# Altium schematic sheet AC_Block.SchDoc
size A4; SheetNumber: 4; SheetTotal: 9
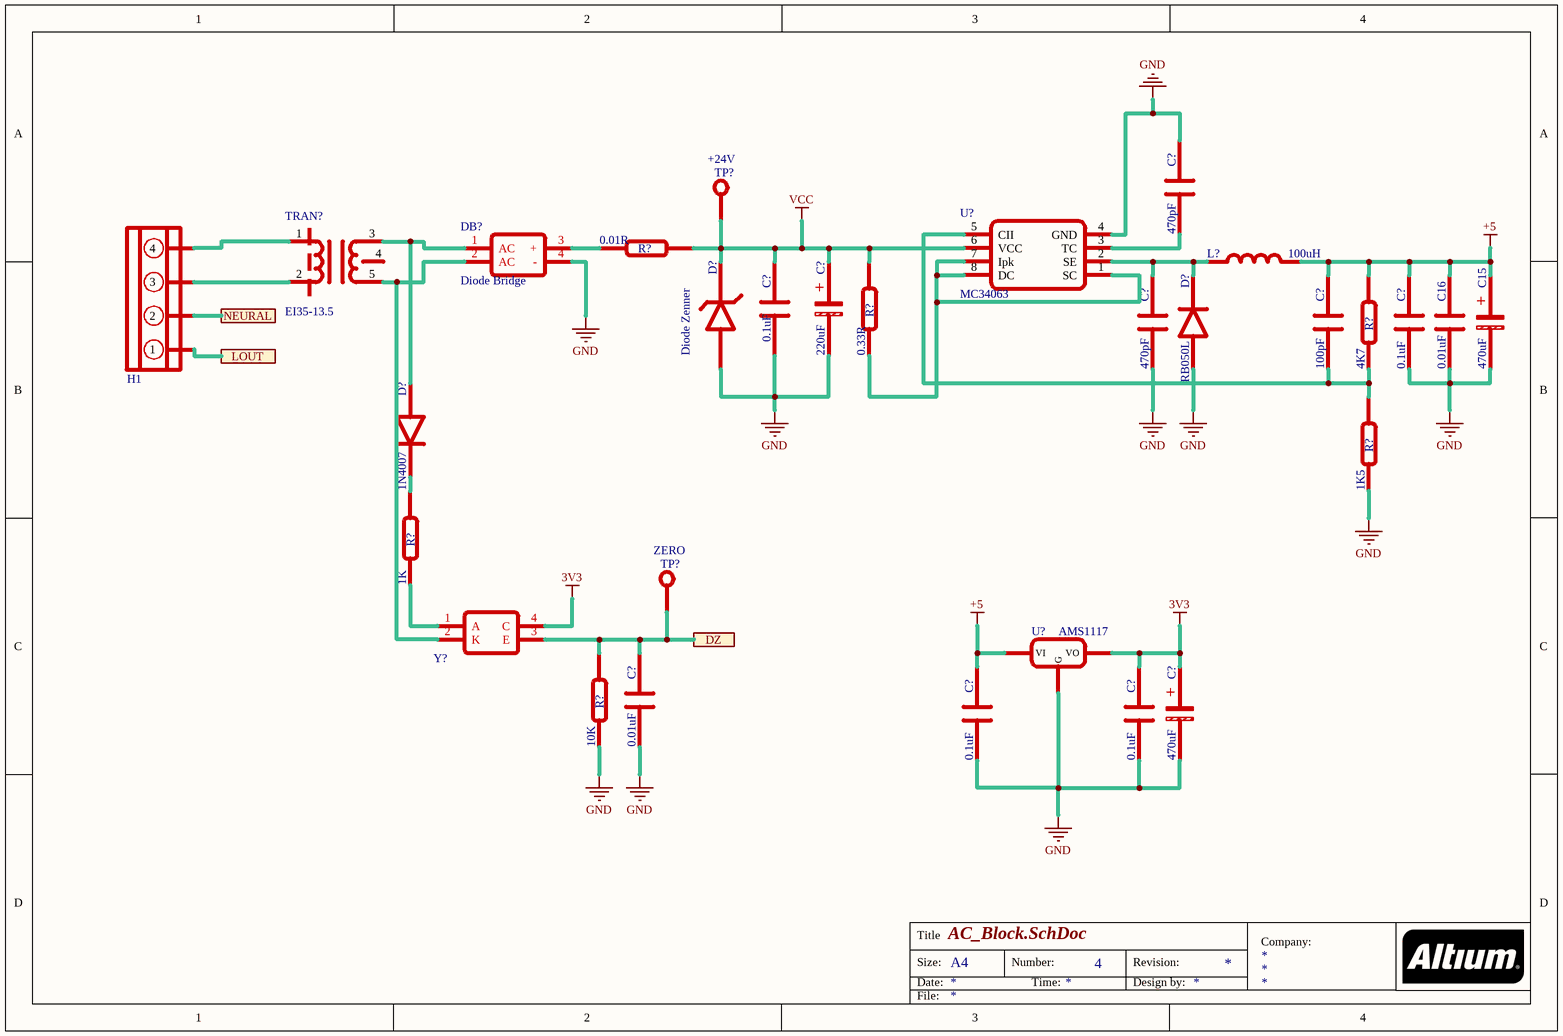
[diagram p0: AC_Block.SchDoc]

## Parts
(Parts that share a designator on the sheet are numbered #1, #2 ... from top to bottom, then left to right.)
C15  470uF  [CAP-AL-4x5.4]
C16  0.01uF  [C0603]
C?#1  470pF  [C0603]
C?#2  0.1uF  [C0402]
C?#3  220uF  [CAP-AL-4x5.4]
C?#4  470pF  [C0603]
C?#5  100pF  [C0603]
C?#6  0.1uF  [C0603]
C?#7  0.01uF  [C0402]
C?#8  0.1uF  [C0402]
C?#9  0.1uF  [C0402]
C?#10  470uF  [CAP-AL-4x5.4]
D?#1  Diode Zenner  [DIODE-1/2W-SMD-MELF]
D?#2  RB050L  [SMA]
D?#3  1N4007  [SMA]
DB?  Diode Bridge  [MBS-4]
H1  DG125-5.08-4P  [DG125-5.08-4P]  (value not drawn)
L?  100uH  [IND1206]
R?#1  0.01R  [R0603]
R?#2  0.33R  [R0603]
R?#3  4K7  [R0603]
R?#4  1K5  [R0603]
R?#5  1K  [R0603]
R?#6  10K  [R0603]
TP?#1  +24V  [Test Point]
TP?#2  ZERO  [Test Point]
TRAN?  EI35-13.5  [ZN35135BA]
U?#1  MC34063  [SOIC-8]
U?#2  AMS1117  [SOT-223]
Y?  PC817  [SOP-4]  (value not drawn)

## Ports
DZ, LOUT, NEURAL

## Nets
3V3: C?#9.2 C?#10.1 U?#2.2(VO) Y?.4(C)
+5: C15.1 C16.2 C?#5.2 C?#6.2 C?#8.2 L?.2 R?#3.2 U?#2.3(VI)
GND: C15.2 C16.1 C?#1.2 C?#2.1 C?#3.2 C?#4.1 C?#6.1 C?#7.1 C?#8.1 C?#9.1 C?#10.2 D?#1.A D?#2.A DB?.4(-) R?#4.1 R?#6.1 U?#1.4(GND) U?#2.1(G)
VCC: C?#2.2 C?#3.1 D?#1.K R?#1.2 R?#2.2 TP?#1.1 U?#1.6(VCC)
DZ: C?#7.2 R?#6.2 TP?#2.1 Y?.3(E) ; port DZ
LOUT: H1.1 ; port LOUT
NEURAL: H1.2 ; port NEURAL
NetC?#1_1: C?#1.1 U?#1.3(TC)
NetC?#4_2: C?#4.2 D?#2.K L?.1 U?#1.2(SE)
NetC?#5_1: C?#5.1 R?#3.1 R?#4.2 U?#1.5(CII)
NetD?#3_A: D?#3.A DB?.1(AC) TRAN?.3
NetD?#3_K: D?#3.K R?#5.2
NetDB?_2: DB?.2(AC) TRAN?.5 Y?.2(K)
NetDB?_3: DB?.3(+) R?#1.1
NetH1_3: H1.3 TRAN?.2
NetH1_4: H1.4 TRAN?.1
NetR?#2_1: R?#2.1 U?#1.1(SC) U?#1.7(Ipk) U?#1.8(DC)
NetR?#5_1: R?#5.1 Y?.1(A)

Not connected (* = marked no-connect by the designer): TRAN? 4

## Notes on the sheet
- Title
- Size:
- Date:
- A4
- Number:
- Time:
- Revision:
- Design by:
- Company:
- File:
- (in symbol CAP-ALU) +

## Library data of the parts
C15 C?#3 C?#10 = CAP-ALU: Aluminum Capacitor
C16 C?#1 C?#2 C?#4-C?#9 = CAP-CER: Ceramic Capacitor
D?#1 = Diode Zener: Zenner diodes; pin to pad: A>1 K>2
D?#3 = Diode
H1 = DG125-5.08-4P: Connector 5.08MM Pitch Vertical 4 Pole
L? = Inductor: Inductors
R?#1-R?#6 = Resistor
TP?#1 TP?#2 = TestPoint: Test Point
TRAN? = EI35-13.5: Tranfomers Horizontal 220-24VA
U?#1 = MC34063: CII; ComponentLink1Description: MC34063; ComponentLink1URL: https://www.ti.com/lit/ds/symlink/mc34063a.pdf?ts=1754727849604&ref_url=https%253A%252F%252Fwww.ti.com%252Fproduct%252FMC34063A%253Futm_source%253Dgoogle%2526utm_medium%253Dcpc%2526utm_campaign%253Dapp-bmc-null-44700045336317401_prodfolderdynamic-cpc-pf-google-ww_en_int%2526utm_content%253Dprodfolddynamic%2526ds_k%253DDYNAMIC+SEARCH+ADS%2526DCM%253Dyes%2526gclsrc%253Daw.ds%2526gad_source%253D1%2526gad_campaignid%253D8020569589%2526gbraid%253D0AAAAAC068F2IaUpoCFmSUAJGne2nFQnJ4%2526gclid%253DCjwKCAjw49vEBhAVEiwADnMbbCvKEYMYR5F0u0gQ7iDo_BXycNOSztYqerTJ4l5B7ap-K9YFss-WaRoCkVsQAvD_BwE
U?#2 = AMS1117: Regulator intergated chip; pin to pad: 4>2; ComponentLink1Description: AMS1117-3.3; ComponentLink1URL: https://mm.digikey.com/Volume0/opasdata/d220001/medias/docus/6283/AMS1117-2.5.pdf
Y? = PC817: Photo-Coupler; ComponentLink1Description: PC817; ComponentLink1URL: https://www.socle-tech.com/doc/IC%20Channel%20Product/Optoelectronic%20Components/Photocoupler/PC8171_NIP1B_ED-16P023.pdf